# Altium schematic sheet [13] - CONNECTOR.SchDoc
size A4; Size: A4; Contact: datasystem.pl
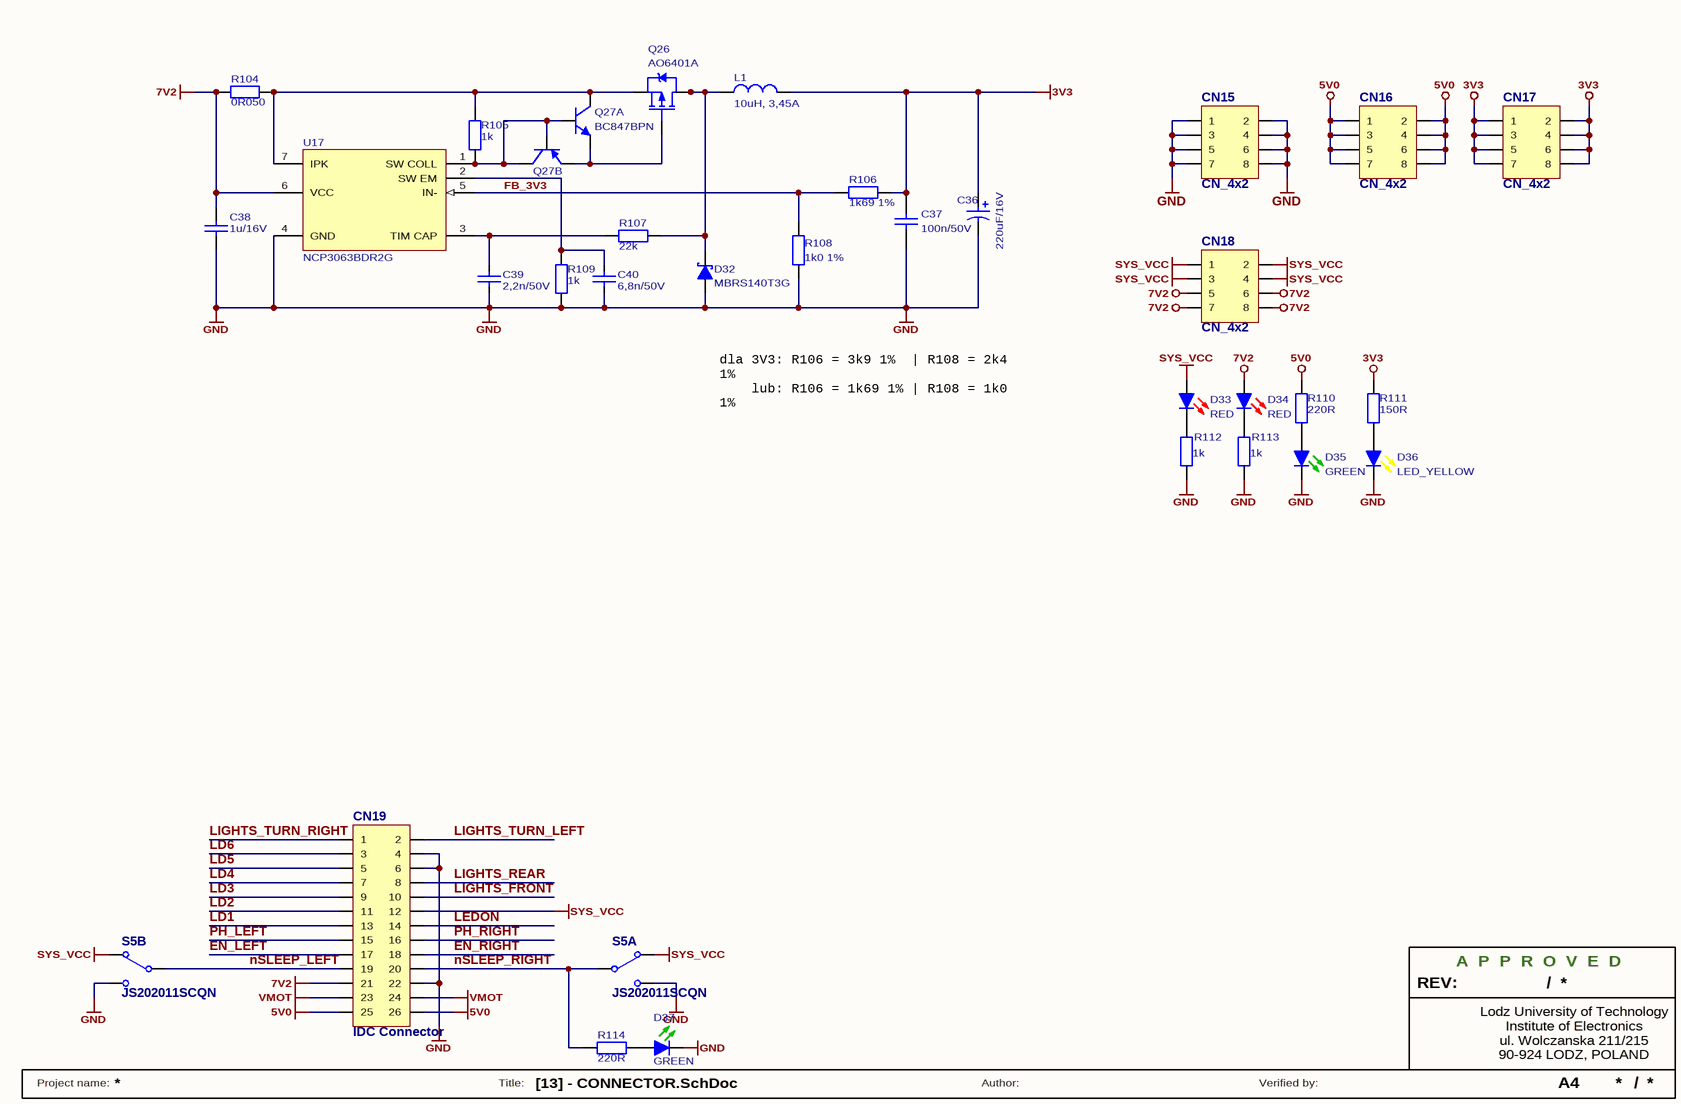
[diagram p0: [13] - CONNECTOR.SchDoc]

## Parts
C36  220uF/16V  [CES_E_8.3x8.3_6.2]
C37  100n/50V  [C0805]
C38  1u/16V  [C0805]
C39  2,2n/50V  [C0805]
C40  6,8n/50V  [C0805]
CN15  CN_4x2  [GP_4x2]
CN16  CN_4x2  [GP_4x2]
CN17  CN_4x2  [GP_4x2]
CN18  CN_4x2  [GP_4x2]
CN19  IDC Connector  [IDC26_RA_LONG_W_CN]
D32  MBRS140T3G  [SMB]
D33  RED  [LED0805R]
D34  RED  [LED0805R]
D35  GREEN  [LED0805G]
D36  LED_YELLOW  [LED0805Y]
D37  GREEN  [LED0805G]
L1  10uH, 3,45A  [PSDB1005]
Q26  AO6401A  [SOT-23-6]
Q27  BC847BPN  [SOT-323-6 (SOT-363, SC88, SC70-6)]  (parts A,B of 2)
R104  0R050  [R0805]
R105  1k  [R0805]
R106  1k69 1%  [R0805]
R107  22k  [R0805]
R108  1k0 1%  [R0805]
R109  1k  [R0805]
R110  220R  [R0805]
R111  150R  [R0805]
R112  1k  [R0805]
R113  1k  [R0805]
R114  220R  [R0805]
S5  JS202011SCQN  [JS202011SCQN]  (parts A,B of 2)
U17  NCP3063BDR2G  [SO8]

## Nets
3V3: C36.1 C37.2 CN17.1 CN17.2 CN17.3 CN17.4 CN17.5 CN17.6 CN17.7 CN17.8 L1.2 R106.2 R111.1
5V0: CN16.1 CN16.2 CN16.3 CN16.4 CN16.5 CN16.6 CN16.7 CN16.8 CN19.25 CN19.26 R110.1
7V2: C38.2 CN18.5 CN18.6 CN18.7 CN18.8 CN19.21 D34.1(A) R104.1 U17.6(VCC)
GND: C36.2 C37.1 C38.1 C39.1 C40.1 CN15.1 CN15.2 CN15.3 CN15.4 CN15.5 CN15.6 CN15.7 CN15.8 CN19.4 CN19.6 CN19.22 D32.1(A) D35.2(K) D36.2(K) D37.2(K) R108.2 R109.2 R112.2 R113.2 S5.3(NO1) S5.6(NO2) U17.4(GND)
SYS_VCC: CN18.1 CN18.2 CN18.3 CN18.4 CN19.12 D33.1(A) S5.2(NC1) S5.4(NC2)
VMOT: CN19.23 CN19.24
EN_LEFT: CN19.17
EN_RIGHT: CN19.18
FB_3V3: R106.1 R108.1 U17.5(IN-)
LD1: CN19.13
LD2: CN19.11
LD3: CN19.9
LD4: CN19.7
LD5: CN19.5
LD6: CN19.3
LEDON: CN19.14
LIGHTS_FRONT: CN19.10
LIGHTS_REAR: CN19.8
LIGHTS_TURN_LEFT: CN19.2
LIGHTS_TURN_RIGHT: CN19.1
nSLEEP_LEFT: CN19.19 S5.5(COMMON2)
nSLEEP_RIGHT: CN19.20 R114.1 S5.1(COMMON1)
PH_LEFT: CN19.15
PH_RIGHT: CN19.16
NetC39_2: C39.2 R107.2 U17.3(TIM_CAP)
NetC40_2: C40.2 R109.1 U17.2(SW_EM)
NetD32_2: D32.2(K) L1.1 Q26.1(D) Q26.2(D) Q26.5(D) Q26.6(D) R107.1
NetD33_2: D33.2(K) R112.1
NetD34_2: D34.2(K) R113.1
NetD35_1: D35.1(A) R110.2
NetD36_1: D36.1(A) R111.2
NetD37_1: D37.1(A) R114.2
NetQ26_3: Q26.3(G) Q27.1(EA) Q27.4(EB)
NetQ26_4: Q26.4(S) Q27.6(CA) R104.2 R105.1 U17.7(IPK)
NetQ27_2: Q27.2(BA) Q27.3(CB) Q27.5(BB) R105.2 U17.1(SW_COLL)

## Notes on the sheet
- dla 3V3: R106 = 3k9 1%  | R108 = 2k4 1%
  lub: R106 = 1k69 1% | R108 = 1k0 1%
- REV:
- A  P  P  R  O  V  E  D
- /
- Lodz University of Technology
- ul. Wolczanska 211/215
- 90-924 LODZ, POLAND
- Institute of Electronics
- Project name:
- Title:
- Author:
- Verified by:

## Library data of the parts
C36 = Cap Pol: Polarized Capacitor; ComponentLink1Description: datasheet; ComponentLink2Description: supplier; Value: 220uF/16V
C37-C40 = Cap: Capacitor; ComponentLink1Description: datasheet; ComponentLink2Description: supplier
  C37: Value: 100n/50V
  C38: Value: 1u/16V
  C39: Value: 2,2n/50V
  C40: Value: 6,8n/50V
CN19 = CN_13x2
D32 = MBRS140T3G: Schottky barrier rectifier: 40V, 1A; Published: 22-Nov-2006; PackageReference: SMB; Supplier 1: TME; Supplier 2: Farnell; Supplier Part Number 1: MBRS140T3G; Supplier Part Number 2: 1467526
D33 D34 = LED_RED: RED LED; Published: 04-Apr-2006
D35 D37 = LED_GREEN: GREEN LED; Published: 04-Apr-2006
D36 = LED_YELLOW: YELLOW LED; Published: 04-Apr-2006
L1 = PSDB1005NT100: 10uH, 20%, 3,45A, PSDB1005N Series Inductor; Published: 08-Mar-2006; ComponentLink1Description: datasheet; ComponentLink2Description: supplier; Supplier 1: TME; Supplier Part Number 1: PSDB1005NT100; Value: 10uH, 3,45A
Q26 = AO6401A: P-Channel MOSFET; -60V, -5A, 1.3W;; Supplier 1: TME; Supplier Part Number 1: AO6401A
Q27 = BC847BPN: PNP/NPN General Purpose Transistor (VCE=45V, IC=100mA); Supplier 1: TME; Supplier 2: Farnell; Supplier 3: Farnell; Supplier 4: Farnell; Supplier Part Number 1: BC847BPN.115; Supplier Part Number 2: 2336824; Supplier Part Number 3: 1081233RL; Supplier Part Number 4: 1081233
R104-R114 = Res: Resistor; Published: 19-Feb-2006; ComponentLink1Description: datasheet; ComponentLink2Description: supplier
  R104: Value: 0R050
  R105 R109 R112 R113: Value: 1k
  R106: Value: 1k69 1%
  R107: Value: 22k
  R108: Value: 1k0 1%
  R110 R114: Value: 220R
  R111: Value: 150R
S5 = JS202011SCQN: C&K JS202011SCQN DPDT Switch; Published: 24-Mar-1999; Revision: July-2002: Re-released for DXP Platform.; Publisher: Altium Limited; Supplier 1: Farnell; Supplier 2: Farnell; Supplier Part Number 1: 2320019RL; Supplier Part Number 2: 2320019
U17 = NCP3063BDR2G: DC-DC Converter NCP3063BDR2G (Farnell 1547126); Published: 22-Nov-2006; PackageReference: SO8; Supplier 1: Farnell; Supplier 2: Farnell; Supplier 3: Farnell; Supplier Part Number 1: 1547126; Supplier Part Number 2: 2126136; Supplier Part Number 3: 1547126RL